# EAGLE design PermaProtoHalfSizewithISPV2 (EAGLE 9.4.2)
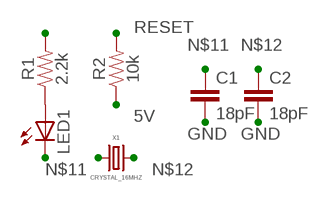
[diagram p0: schematic, sheet 1]

## Parts
C1  18pF  18PF-0603-50V-5%  [0603]
C2  18pF  18PF-0603-50V-5%  [0603]
LED1  LEDCHIP-LED0603  [CHIP-LED0603]
R1  2.2k  2.2KOHM-0603-1/10W-1%  [0603]
R2  10k  10KOHM-0603-1/10W-1%  [0603]
X1  CRYSTAL_16MHZ  [HC49US]

## Nets
5V: R2.1
GND: C1.2 C2.2 LED1.C
N$11: C1.1 X1.1
N$12: C2.1 X1.2
N$65: LED1.A R1.1
RESET: R2.2
SCK: R1.2

## Library data of the parts
C1 C2 = SparkFun-Capacitors:18PF: 18pF ceramic capacitors A capacitor is a passive two-terminal electrical component used to store electrical energy temporarily in an electric field.; PROD_ID: CAP-08267
LED1 = adafruit:LED: LED OSRAM: - CHIPLED LG R971, LG N971, LY N971, LG Q971, LY Q971, LO R971, LY R971 LH N974, LH R974 LS Q976, LO Q976, LY Q976 LO Q996 - Hyper CHIPLED LW Q18S LB Q993, LB Q99A, LB R99A - SideLED LS A670, LO A670, LY A670, LG A670, LP A670 LB A673, LV A673, LT A673, LW A673 LH A674 LY A675 LS A676, LA A676, LO A676, LY A676, LW A676 LS A679, LY A679, LG A679 - Hyper Micro SIDELED® LS Y876, LA Y876, LO Y876, LY Y876 LT Y87S - SmartLED LW L88C, LW L88S LB L89C, LB L89S, LG L890 LS L89K, LO L89K, LY L89K LS L896, LA L896, LO L896, LY L896 - TOPLED LS T670, LO T670, LY T670, LG T670, LP T670 LSG T670, LSP T670, LSY T670, LOP T670, LYG T670 LG T671, LOG T671, LSG T671 LB T673, LV T673, LT T673, LW T673 LH T674 LS T676, LA T676, LO T676, LY T676, LB T676, LH T676, LSB T676, LW T676 LB T67C, LV T67C, LT T67C, LS T67K, LO T67K, LY T67K, LW E67C LS E67B, LA E67B, LO E67B, LY E67B, LB E67C, LV E67C, LT E67C LW T67C LS T679, LY T679, LG T679 LS T770, LO T770, LY T770, LG T770, LP T770 LB T773, LV T773, LT T773, LW T773 LH T774 LS E675, LA E675, LY E675, LS T675 LS T776, LA T776, LO T776, LY T776, LB T776 LHGB T686 LT T68C, LB T68C - Hyper Mini TOPLED® LB M676 - Mini TOPLED Santana® LG M470 LS M47K, LO M47K, LY M47K Source: http://www.osram.convergy.de/
R1 = SparkFun-Resistors:2.2KOHM: 2.2kΩ resistor A resistor is a passive two-terminal electrical component that implements electrical resistance as a circuit element. Resistors act to reduce current flow, and, at the same time, act to lower voltage levels within circuits. - Wikipedia; PROD_ID: RES-08272
R2 = SparkFun-Resistors:10KOHM: 10kΩ resistor A resistor is a passive two-terminal electrical component that implements electrical resistance as a circuit element. Resistors act to reduce current flow, and, at the same time, act to lower voltage levels within circuits. - Wikipedia; PROD_ID: RES-00824
X1 = ACES_THT:CRYSTAL_16MHZ

## Board
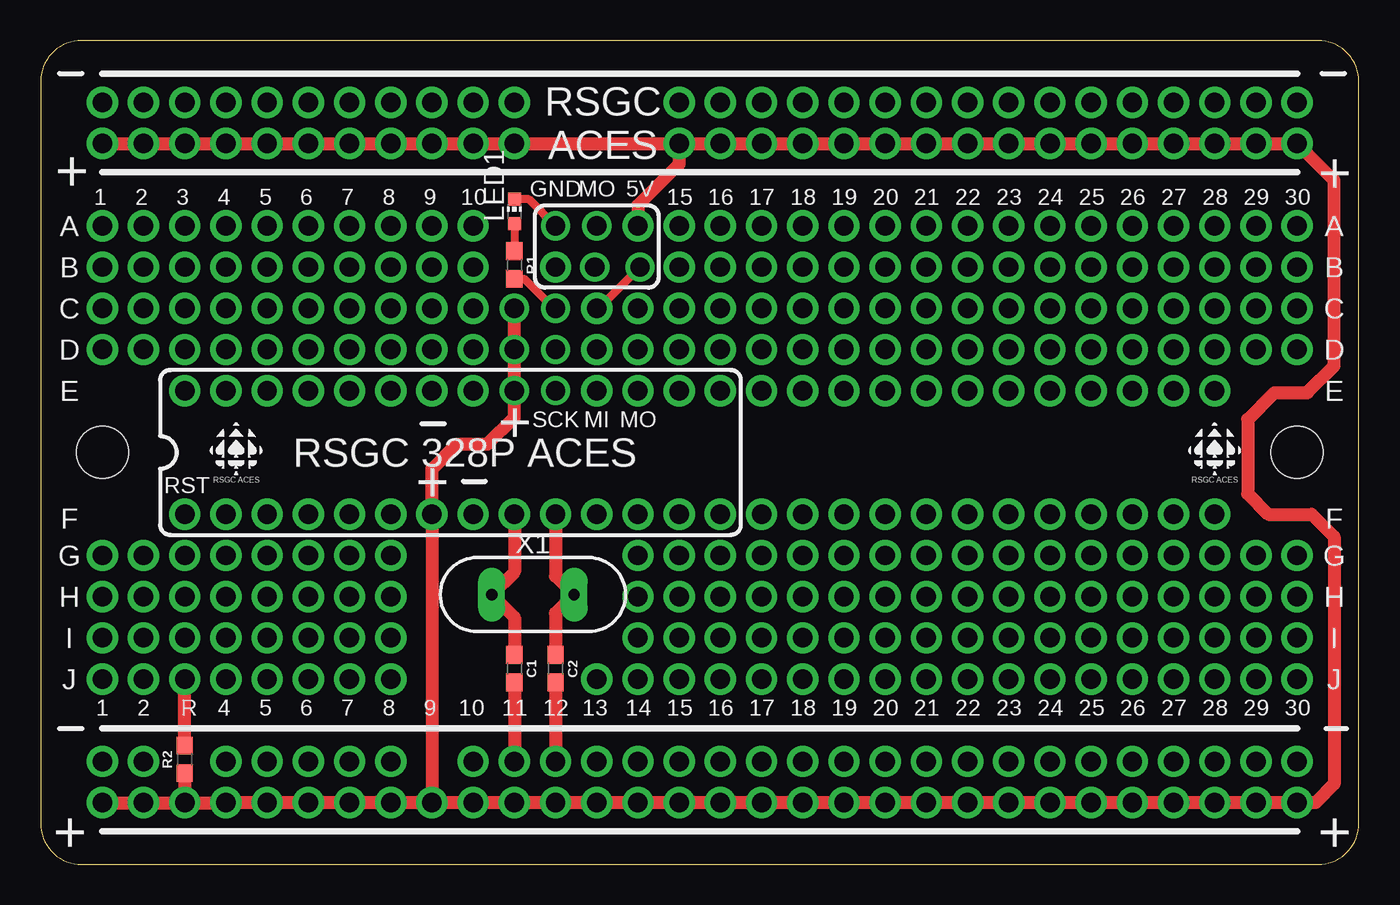
[diagram p1: board, top side]
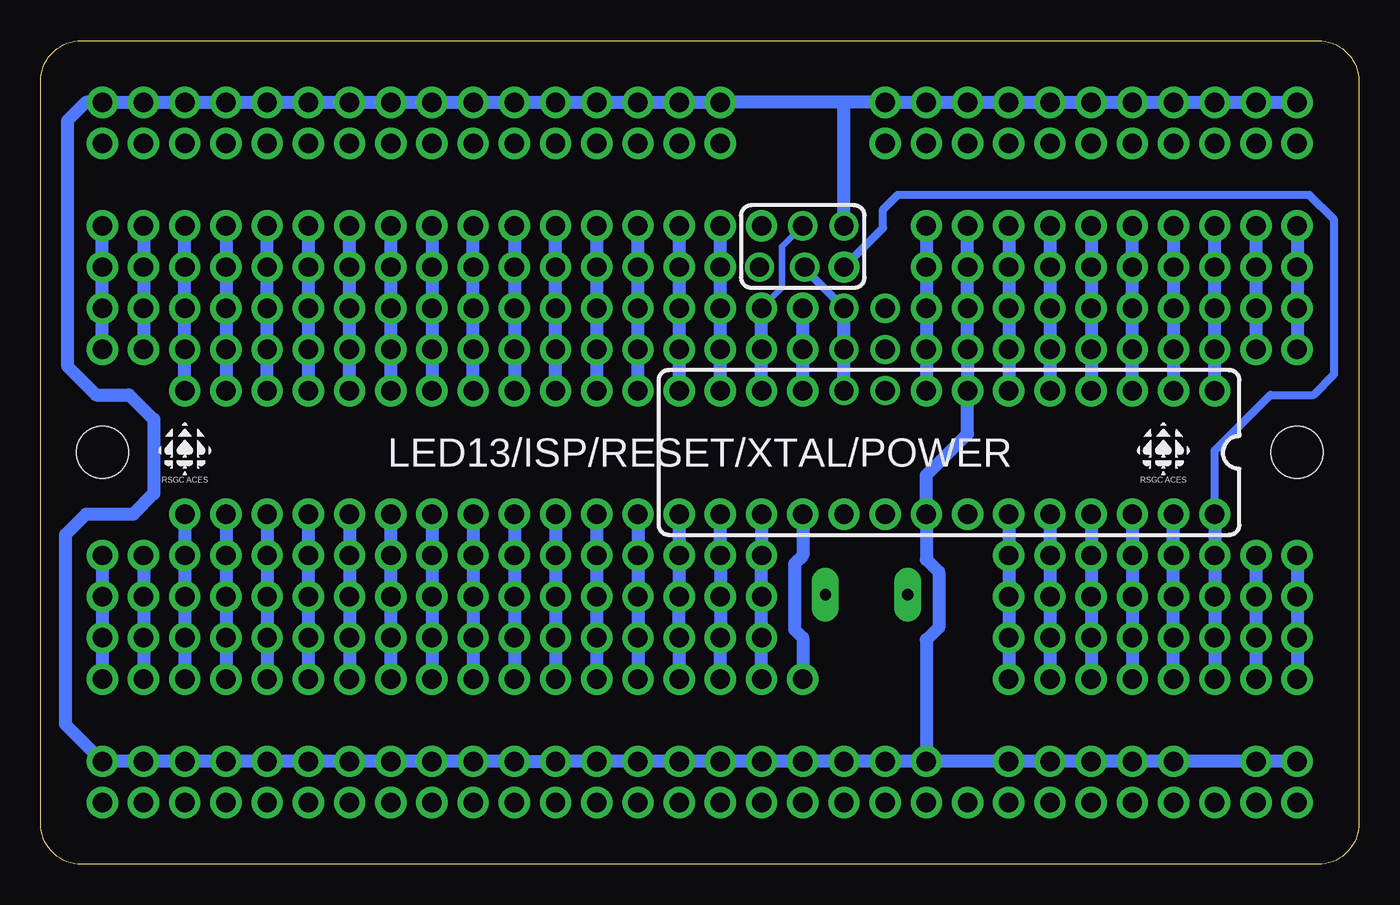
[diagram p2: board, bottom side, seen from below]

Size 81.28 x 50.8 mm. Coordinates in mm from the lower left corner, seen from the top.
Outline: 2.54,50.8 arc90 0,48.26 0,2.54 arc90 2.54,0 78.74,0 arc90 81.28,2.54 81.28,48.26 arc90 78.74,50.8 2.54,50.8
Copper layers (1*16): Top 0.035mm / dielectric 1.5mm / Bottom 0.035mm
Design rules "JLCPCB": minimum track width 20mil, minimum drill 0.35mm, track to track 10mil, track to pad 10mil, pad to pad 10mil, via to via 10mil, smd to smd 10mil, copper to edge 10mil, drill to drill 12mil, minimum pad ring 10mil, minimum via ring 8mil, stop-mask expansion 4mil, vias tented up to drill 0mil, thermal gap 10mil
Holes 3.2 mm at 3.81,25.4 77.47,25.4

### Footprints (pad centres in the part's own frame; a part is rotated, then mirrored left to right if it is on the bottom)
0603 = smd 1.1 x 1: 1 -0.85,0; 2 0.85,0
CHIP-LED0603 = smd 0.8 x 0.8: A 0,-0.75; C 0,0.75
HC49US = drill 0.7 pad 1.651 long: 1 -2.54,0; 2 2.54,0

### Placement (x,y rotation side)
C1  29.21,12.06 270 top
C2  31.75,12.06 270 top
LED1  29.21,40.26 0 top
R1  29.21,36.96 270 top
R2  8.89,6.48 90 top
U$1  [SMALL_TSILK_TEXT]  12.07,25.65 0 top
U$2  [SMALL_TSILK_TEXT]  72.39,25.65 0 top
U$3  [SMALL_BSILK_TEXT]  72.39,25.65 0 top
U$4  [SMALL_BSILK_TEXT]  12.07,25.65 0 top
X1  30.35,16.64 0 top

### Tracks (layer width: path | path; a pad name or v marks a point on that pad's centre or on a via)
5V  (via drill 1.2 pad 1.3, 1.2 pad 1.93)
  Top 0.813: v3.81,44.45 v6.35,44.45 v8.89,44.45 v11.43,44.45 v13.97,44.45 v16.51,44.45 v19.05,44.45 v21.59,44.45 v24.13,44.45 v26.67,44.45 v29.21,44.45 v39.37,44.45 | v39.37,44.45 v41.91,44.45 v44.45,44.45 v46.99,44.45 v49.53,44.45 v52.07,44.45 v54.61,44.45 v57.15,44.45 v59.69,44.45 v62.23,44.45 v64.77,44.45 v67.31,44.45 v69.85,44.45 v72.39,44.45 v74.93,44.45 v77.47,44.45 79.76,42.16 79.76,30.73 78.11,29.08 76.07,29.08 74.42,27.43 74.42,22.86 75.69,21.59 78.36,21.59 79.76,20.19 79.76,4.95 78.61,3.81 v77.47,3.81 v74.93,3.81 v72.39,3.81 v69.85,3.81 v67.31,3.81 v64.77,3.81 v62.23,3.81 v59.69,3.81 v57.15,3.81 v54.61,3.81 v52.07,3.81 v49.53,3.81 v46.99,3.81 v44.45,3.81 v41.91,3.81 v39.37,3.81 v36.83,3.81 v34.29,3.81 v31.75,3.81 v29.21,3.81 v26.67,3.81 v24.13,3.81 | v24.13,3.81 v21.59,3.81 v19.05,3.81 v16.51,3.81 v13.97,3.81 v11.43,3.81 v8.89,3.81 | v39.37,44.45 39.37,43.18 36.83,40.64 v36.83,39.37 | v24.13,3.81 v24.13,21.59 24.13,24.38 25.65,25.91 27.56,25.91 29.21,27.56 v29.21,29.21 v29.21,31.75 v29.21,34.29 | v3.81,3.81 v6.35,3.81 v8.89,3.81 | R2.1 v8.89,3.81
GND  (via drill 1.2 pad 1.3, 1.2 pad 1.93)
  Top 0.508: LED1.C 30.11,41.01 v31.75,39.37
  Top 0.813: C1.2 v29.21,6.35 | C2.2 v31.75,6.35
  Bottom 0.813: v3.81,46.99 v6.35,46.99 v8.89,46.99 v11.43,46.99 v13.97,46.99 v16.51,46.99 v19.05,46.99 v21.59,46.99 v24.13,46.99 v26.67,46.99 v29.21,46.99 31.62,46.99 | v26.67,6.35 v21.59,6.35 v19.05,6.35 v16.51,6.35 v13.97,6.35 v11.43,6.35 v6.35,6.35 v3.81,6.35 | v26.67,6.35 v29.21,6.35 v31.75,6.35 v34.29,6.35 v36.83,6.35 v39.37,6.35 v41.91,6.35 v44.45,6.35 v46.99,6.35 v49.53,6.35 v52.07,6.35 v54.61,6.35 v57.15,6.35 v59.69,6.35 v62.23,6.35 v64.77,6.35 v67.31,6.35 v69.85,6.35 v72.39,6.35 v74.93,6.35 v77.47,6.35 79.76,8.64 79.76,20.32 78.49,21.59 75.56,21.59 74.3,22.86 74.3,27.43 75.82,28.96 77.85,28.96 79.63,30.73 79.63,45.85 78.49,46.99 v77.47,46.99 v74.93,46.99 v72.39,46.99 v69.85,46.99 v67.31,46.99 v64.77,46.99 v62.23,46.99 v59.69,46.99 v57.15,46.99 v54.61,46.99 v52.07,46.99 v49.53,46.99 v46.99,46.99 v44.45,46.99 v41.91,46.99 v39.37,46.99 31.62,46.99 | v31.75,39.37 31.75,46.86 31.62,46.99 | v24.13,39.37 v24.13,36.83 v24.13,34.29 v24.13,31.75 v24.13,29.21 24.13,26.54 26.67,24 v26.67,21.59 26.67,18.8 25.91,18.03 25.91,14.6 26.67,13.84 v26.67,6.35
MISO  (via drill 1.2 pad 1.3, 1.2 pad 1.93)
  Top 0.508: v36.96,36.83 34.42,34.29 v34.29,34.29
  Bottom 0.813: v34.29,29.21 v34.29,31.75 v34.29,34.29
MOSI  (via drill 1.2 pad 1.15, 1.2 pad 1.93)
  Bottom 0.406: v34.29,39.37 35.56,38.1 35.56,35.56 v36.83,34.29
  Bottom 0.813: v36.83,29.21 v36.83,31.75 v36.83,34.29
N$1  (via drill 1.2 pad 1.93)
  Bottom 0.813: v3.81,19.05 v3.81,16.51 v3.81,13.97 v3.81,11.43
N$2  (via drill 1.2 pad 1.93)
  Bottom 0.813: v6.35,19.05 v6.35,16.51 v6.35,13.97 v6.35,11.43
N$4  (via drill 1.2 pad 1.93)
  Bottom 0.813: v11.43,11.43 v11.43,13.97 v11.43,16.51 v11.43,19.05 v11.43,21.59
N$5  (via drill 1.2 pad 1.93)
  Bottom 0.813: v13.97,21.59 v13.97,19.05 v13.97,16.51 v13.97,13.97 v13.97,11.43
N$6  (via drill 1.2 pad 1.93)
  Bottom 0.813: v16.51,21.59 v16.51,19.05 v16.51,16.51 v16.51,13.97 v16.51,11.43
N$7  (via drill 1.2 pad 1.93)
  Bottom 0.813: v21.59,21.59 v21.59,19.05 v21.59,16.51 v21.59,13.97 v21.59,11.43
N$8  (via drill 1.2 pad 1.93)
  Bottom 0.813: v19.05,21.59 v19.05,19.05 v19.05,16.51 v19.05,13.97 v19.05,11.43
N$11  (via drill 1.2 pad 1.93)
  Top 0.813: v29.21,21.59 29.21,18.03 X1.1 29.21,15.24 C1.1
N$12  (via drill 1.2 pad 1.93)
  Top 0.813: v31.75,21.59 31.75,17.78 X1.2 31.75,15.49 C2.1
N$13  (via drill 1.2 pad 1.93)
  Bottom 0.813: v34.29,21.59 34.29,19.05 34.8,18.54 34.8,14.48 34.29,13.97 v34.29,11.43
N$14  (via drill 1.2 pad 1.93)
  Bottom 0.813: v36.83,21.59 v36.83,19.05 v36.83,16.51 v36.83,13.97 v36.83,11.43
N$15  (via drill 1.2 pad 1.93)
  Bottom 0.813: v39.37,11.43 v39.37,13.97 v39.37,16.51 v39.37,19.05 v39.37,21.59
N$16  (via drill 1.2 pad 1.93)
  Bottom 0.813: v41.91,21.59 v41.91,19.05 v41.91,16.51 v41.91,13.97 v41.91,11.43
N$17  (via drill 1.2 pad 1.93)
  Bottom 0.813: v46.99,21.59 v46.99,19.05 v46.99,16.51 v46.99,13.97 v46.99,11.43
N$18  (via drill 1.2 pad 1.93)
  Bottom 0.813: v44.45,21.59 v44.45,19.05 v44.45,16.51 v44.45,13.97 v44.45,11.43
N$19  (via drill 1.2 pad 1.93)
  Bottom 0.813: v49.53,21.59 v49.53,19.05 v49.53,16.51 v49.53,13.97 v49.53,11.43
N$20  (via drill 1.2 pad 1.93)
  Bottom 0.813: v52.07,21.59 v52.07,19.05 v52.07,16.51 v52.07,13.97 v52.07,11.43
N$21  (via drill 1.2 pad 1.93)
  Bottom 0.813: v57.15,21.59 v57.15,19.05 v57.15,16.51 v57.15,13.97 v57.15,11.43
N$22  (via drill 1.2 pad 1.93)
  Bottom 0.813: v54.61,21.59 v54.61,19.05 v54.61,16.51 v54.61,13.97 v54.61,11.43
N$23  (via drill 1.2 pad 1.93)
  Bottom 0.813: v59.69,21.59 v59.69,19.05 v59.69,16.51 v59.69,13.97 v59.69,11.43
N$24  (via drill 1.2 pad 1.93)
  Bottom 0.813: v62.23,11.43 v62.23,13.97 v62.23,16.51 v62.23,19.05 v62.23,21.59
N$25  (via drill 1.2 pad 1.93)
  Bottom 0.813: v64.77,21.59 v64.77,19.05 v64.77,16.51 v64.77,13.97 v64.77,11.43
N$26  (via drill 1.2 pad 1.93)
  Bottom 0.813: v67.31,21.59 v67.31,19.05 v67.31,16.51 v67.31,13.97 v67.31,11.43
N$27  (via drill 1.2 pad 1.93)
  Bottom 0.813: v72.39,21.59 v72.39,19.05 v72.39,16.51 v72.39,13.97 v72.39,11.43
N$28  (via drill 1.2 pad 1.93)
  Bottom 0.813: v69.85,21.59 v69.85,19.05 v69.85,16.51 v69.85,13.97 v69.85,11.43
N$29  (via drill 1.2 pad 1.93)
  Bottom 0.813: v74.93,19.05 v74.93,16.51 v74.93,13.97 v74.93,11.43
N$30  (via drill 1.2 pad 1.93)
  Bottom 0.813: v77.47,19.05 v77.47,16.51 v77.47,13.97 v77.47,11.43
N$33  (via drill 1.2 pad 1.93)
  Bottom 0.813: v77.47,31.75 v77.47,34.29 v77.47,36.83 v77.47,39.37
N$34  (via drill 1.2 pad 1.93)
  Bottom 0.813: v74.93,39.37 v74.93,36.83 v74.93,34.29 v74.93,31.75
N$35  (via drill 1.2 pad 1.93)
  Bottom 0.813: v72.39,29.21 v72.39,31.75 v72.39,34.29 v72.39,36.83 v72.39,39.37
N$36  (via drill 1.2 pad 1.93)
  Bottom 0.813: v69.85,39.37 v69.85,36.83 v69.85,34.29 v69.85,31.75 v69.85,29.21
N$37  (via drill 1.2 pad 1.93)
  Bottom 0.813: v67.31,29.21 v67.31,31.75 v67.31,34.29 v67.31,36.83 v67.31,39.37
N$38  (via drill 1.2 pad 1.93)
  Bottom 0.813: v64.77,39.37 v64.77,36.83 v64.77,34.29 v64.77,31.75 v64.77,29.21
N$39  (via drill 1.2 pad 1.93)
  Bottom 0.813: v59.69,39.37 v59.69,36.83 v59.69,34.29 v59.69,31.75 v59.69,29.21
N$40  (via drill 1.2 pad 1.93)
  Bottom 0.813: v62.23,29.21 v62.23,31.75 v62.23,34.29 v62.23,36.83 v62.23,39.37
N$41  (via drill 1.2 pad 1.93)
  Bottom 0.813: v57.15,39.37 v57.15,36.83 v57.15,34.29 v57.15,31.75 v57.15,29.21
N$42  (via drill 1.2 pad 1.93)
  Bottom 0.813: v54.61,29.21 v54.61,31.75 v54.61,34.29 v54.61,36.83 v54.61,39.37
N$43  (via drill 1.2 pad 1.93)
  Bottom 0.813: v52.07,39.37 v52.07,36.83 v52.07,34.29 v52.07,31.75 v52.07,29.21
N$44  (via drill 1.2 pad 1.93)
  Bottom 0.813: v49.53,29.21 v49.53,31.75 v49.53,34.29 v49.53,36.83 v49.53,39.37
N$45  (via drill 1.2 pad 1.93)
  Bottom 0.813: v46.99,39.37 v46.99,36.83 v46.99,34.29 v46.99,31.75 v46.99,29.21
N$46  (via drill 1.2 pad 1.93)
  Bottom 0.813: v44.45,29.21 v44.45,31.75 v44.45,34.29 v44.45,36.83 v44.45,39.37
N$47  (via drill 1.2 pad 1.93)
  Bottom 0.813: v41.91,39.37 v41.91,36.83 v41.91,34.29 v41.91,31.75 v41.91,29.21
N$48  (via drill 1.2 pad 1.93)
  Bottom 0.813: v39.37,29.21 v39.37,31.75 v39.37,34.29 v39.37,36.83 v39.37,39.37
N$54  (via drill 1.2 pad 1.93)
  Bottom 0.813: v26.67,39.37 v26.67,36.83 v26.67,34.29 v26.67,31.75 v26.67,29.21
N$55  (via drill 1.2 pad 1.93)
  Bottom 0.813: v21.59,39.37 v21.59,36.83 v21.59,34.29 v21.59,31.75 v21.59,29.21
N$56  (via drill 1.2 pad 1.93)
  Bottom 0.813: v19.05,39.37 v19.05,36.83 v19.05,34.29 v19.05,31.75 v19.05,29.21
N$57  (via drill 1.2 pad 1.93)
  Bottom 0.813: v16.51,39.37 v16.51,36.83 v16.51,34.29 v16.51,31.75 v16.51,29.21
N$58  (via drill 1.2 pad 1.93)
  Bottom 0.813: v13.97,29.21 v13.97,31.75 v13.97,34.29 v13.97,36.83 v13.97,39.37
N$59  (via drill 1.2 pad 1.93)
  Bottom 0.813: v8.89,29.21 v8.89,31.75 v8.89,34.29 v8.89,36.83 v8.89,39.37
N$60  (via drill 1.2 pad 1.93)
  Bottom 0.813: v11.43,39.37 v11.43,36.83 v11.43,34.29 v11.43,31.75 v11.43,29.21
N$61  (via drill 1.2 pad 1.93)
  Bottom 0.813: v6.35,39.37 v6.35,36.83 v6.35,34.29 v6.35,31.75
N$62  (via drill 1.2 pad 1.93)
  Bottom 0.813: v3.81,39.37 v3.81,36.83 v3.81,34.29 v3.81,31.75
N$65
  Top 0.508: LED1.A 29.17,39.5 29.21,39.46 R1.1
RESET  (via drill 1.2 pad 1.93)
  Top 0.813: 8.76,7.45 R2.2 v8.89,11.43
  Bottom 0.508: v31.75,36.83 29.34,39.24 29.34,40.39 28.45,41.27 3.05,41.27 1.52,39.75 1.52,30.23 2.79,28.96 5.46,28.96 8.89,25.53 v8.89,21.59
  Bottom 0.813: v8.89,21.59 v8.89,19.05 v8.89,16.51 v8.89,13.97 v8.89,11.43
SCK  (via drill 1.2 pad 1.3)
  Top 0.508: R1.2 29.81,36.11 31.62,34.29 v31.75,34.29
  Bottom 0.508: v31.75,34.29 34.16,36.7 v34.16,36.83
  Bottom 0.813: v31.75,29.21 v31.75,31.75 v31.75,34.29

### Text on the board
tPlace: GND | MO | 5V | 1 | 2 | 3 | 4 | 5 | 6 | 7 | 8 | 9 | 10 | 15 | 16 | 17 | 18 | 19 | 20 | 21 | 22 | 23 | 24 | 25 | 26 | 27 | 28 | 29 | 30 | A | A | B | B | C | C | D | D | E | E | SCK | MI | MO | RST | F | F | G | G | H | H | I | I | J | J | 1 | 2 | R | 4 | 5 | 6 | 7 | 8 | 9 | 10 | 11 | 12 | 13 | 14 | 15 | 16 | 17 | 18 | 19 | 20 | 21 | 22 | 23 | 24 | 25 | 26 | 27 | 28 | 29 | 30
_tsilk: RSGC / ACES | + | + | + | RSGC 328P ACES | + | + | +
_bsilk: LED13/ISP/RESET/XTAL/POWER